# Altium schematic sheet ICW62081_ICW6208.schdoc.schdoc
size 124 x 101 mm
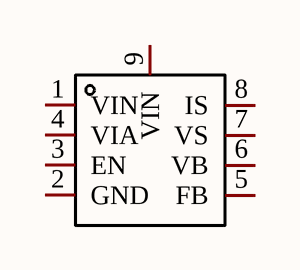
[diagram p0: ICW62081_ICW6208.schdoc.schdoc]

## Parts
U?  ICW6208  [ESOP-8_L4.9-W3.9-P1.27-LS6.0-TL-EP3.3]  (value not drawn)

## Nets

Not connected (* = marked no-connect by the designer): U? 1(VIN) 2(GND) 3(EN) 4(VIA) 5(FB) 6(VB) 7(VS) 8(IS) 9(VIN)

## Library data of the parts
U? = ICW6208: Manufacturer: ICW(艾创微); Add into BOM: yes; Symbol: ICW6208; Device: ICW6208; Supplier: LCSC; Supplier Part: C5448775; Manufacturer Part: ICW6208; JLCPCB Part Class: Extended Part; LCSC Part Name: ICW6208; Supplier Footprint: ESOP-8; Datasheet: https://atta.szlcsc.com/upload/public/pdf/source/20230613/A8AD911CFB7BA22FB46A84D77D648079.pdf; Convert to PCB: yes